# EAGLE design LilyPad-Simblee (EAGLE 7.5.0)
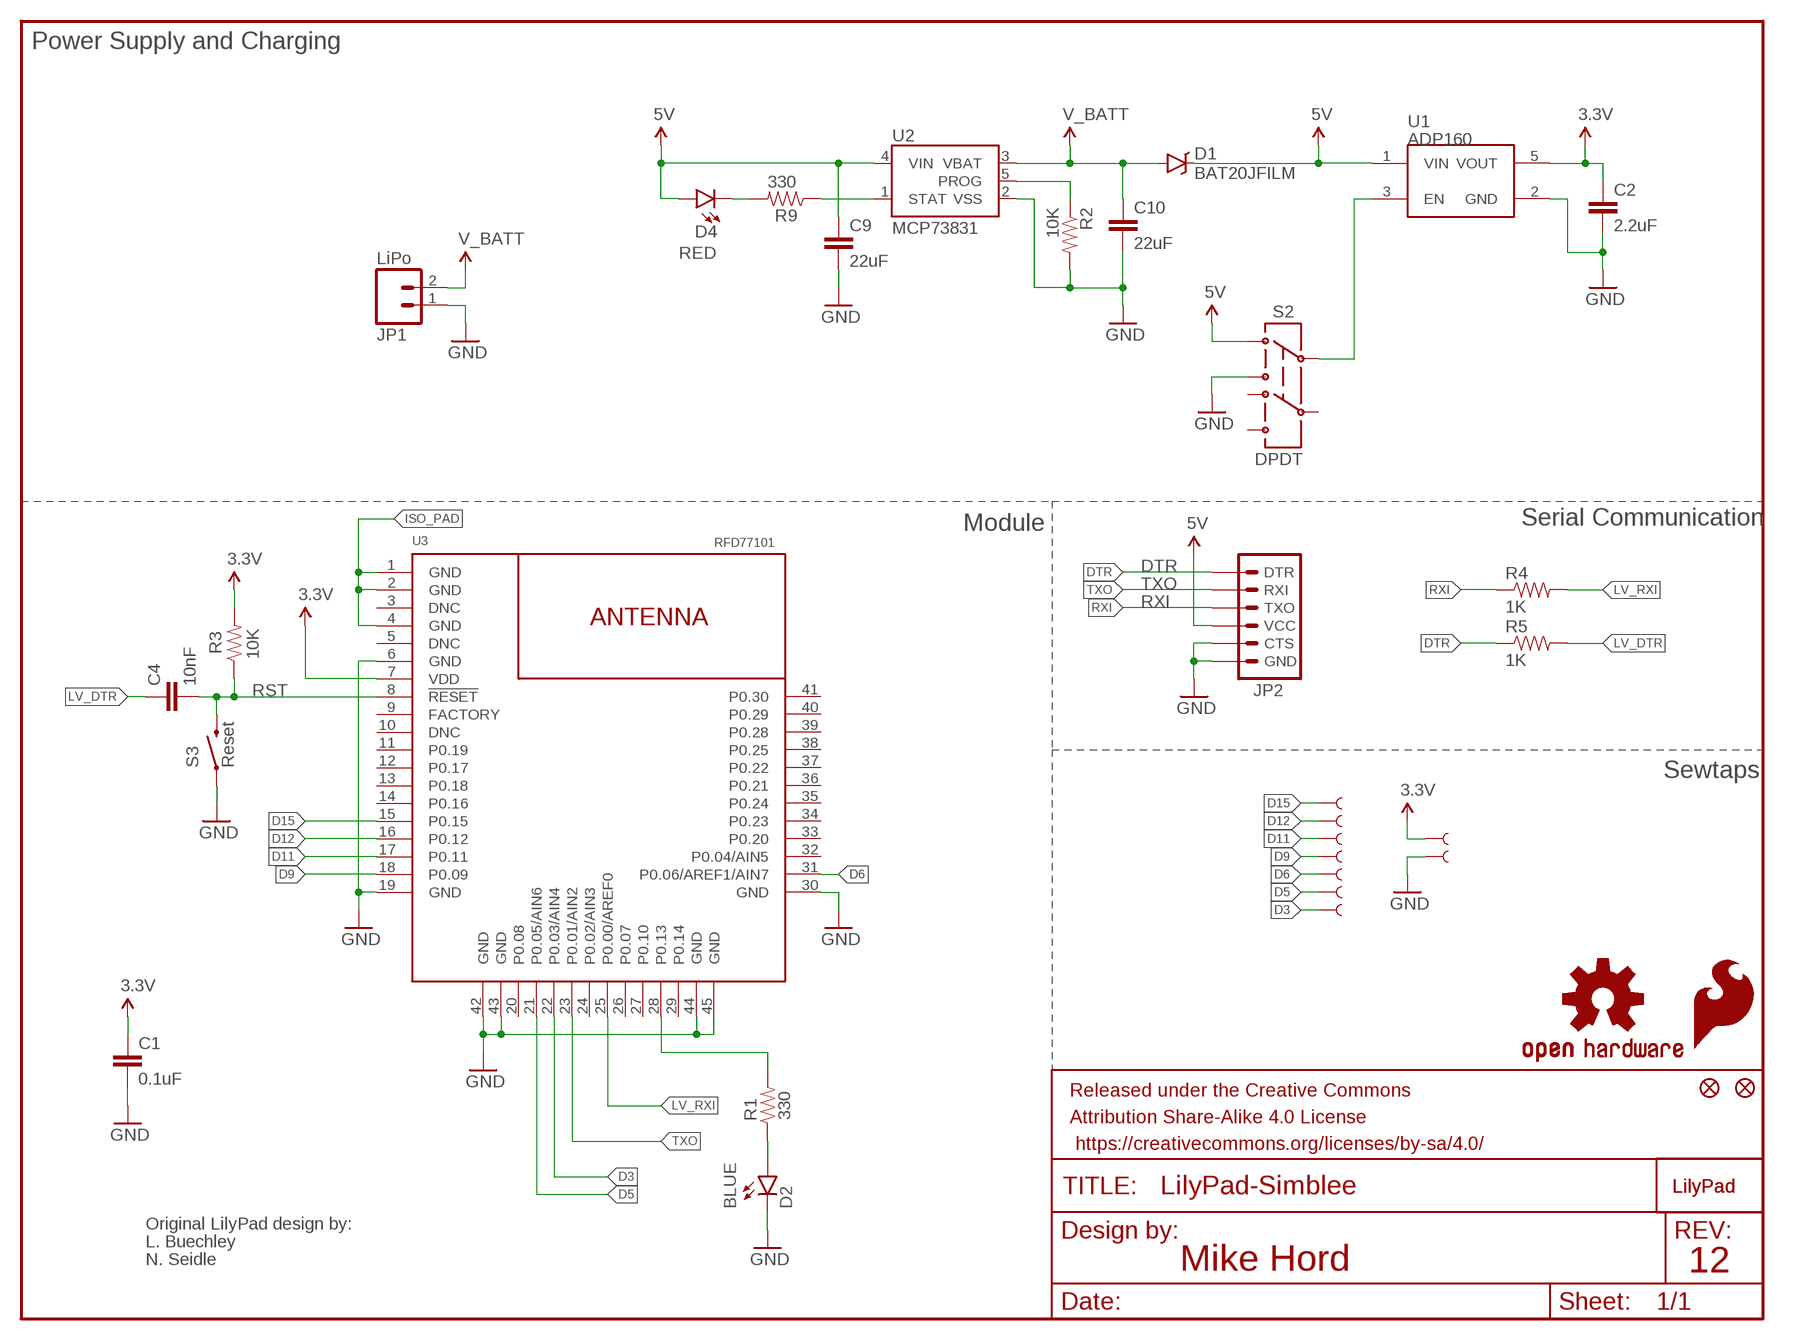
[diagram p0: schematic, sheet 1]

## Parts
A4/18  SEWTAP9  [PETAL-LONG-1-2SIDE]
A5/19  SEWTAP9  [PETAL-LONG-1-2SIDE]
C1  0.1uF  0.1UF-25V(+80/-20%)(0603)  [0603-CAP]
C2  2.2uF  2.2UF-10V-20%(0603)  [0603-CAP]
C4  10nF  10NF/10000PF-50V-10%(0603)  [0603-CAP]
C9  22uF  22UF-6.3V-20%(0805)  [0805]
C10  22uF  22UF-6.3V-20%(0805)  [0805]
D1  BAT20JFILM  [SOD-323]
D2  BLUE  LED-BLUE0603  [LED-0603]
D4  RED  LED-RED0603  [LED-0603]
FID1  FIDUCIALUFIDUCIAL  [MICRO-FIDUCIAL]
FID2  FIDUCIALUFIDUCIAL  [MICRO-FIDUCIAL]
FRAME1  FRAME-LETTER  [CREATIVE_COMMONS]
JP1  LiPo  M02-JST-2MM-SMT  [JST-2-SMD]
JP2  ARDUINO_SERIAL_PROGRAMSMD  [1X06-SMD]
LOGO1  SFE_LOGO_FLAME.1COP  [SFE_LOGO_FLAME_COPPER_.1]
LOGO2  OSHW-LOGOS-COPPER  [OSHW-LOGO-S_COPPER]
R1  330  330OHM1/10W1%(0603)  [0603-RES]
R2  10K  10KOHM-1/10W-1%(0603)0603  [0603-RES]
R3  10K  10KOHM-1/10W-1%(0603)0603  [0603-RES]
R4  1K  1KOHM-1/10W-1%(0603)  [0603-RES]
R5  1K  1KOHM-1/10W-1%(0603)  [0603-RES]
R9  330  330OHM1/10W1%(0603)  [0603-RES]
S2  DPDT  SWITCH-DPDTAYZ0202  [AYZ0202]
S3  Reset  SWITCH-MOMENTARY-2SMD  [TACTILE-SWITCH-SMD]
U1  ADP160  [SOT23-5]
U2  MCP73831  [SOT23-5]
U3  RFD77101  [RFD77101]
U$1  LOGO-LPL  [LOGO-L]
U$2  LOGO-LPLP  [LOGO-LILYPAD]
U$4  SEWTAP9  [PETAL-LONG-1-2SIDE]
U$35  SEWTAP9  [PETAL-LONG-1-2SIDE]
U$37  SEWTAP9  [PETAL-LONG-1-2SIDE]
U$39  SEWTAP9  [PETAL-LONG-1-2SIDE]
U$41  SEWTAP9  [PETAL-LONG-1-2SIDE]
U$43  SEWTAP9  [PETAL-LONG-1-2SIDE]
U$45  SEWTAP9  [PETAL-LONG-1-2SIDE]

## Nets
3.3V: C1.1 C2.1 R3.2 U1.5(VOUT) U3.7(VDD) U$43.1
5V: C9.1 D1.C D4.A JP2.4(VCC) S2.1 U1.1(VIN) U2.4(VIN)
D3: A5/19.1 U3.22(P0.03/AIN4)
D5: U3.21(P0.05/AIN6) U$39.1
D6: A4/18.1 U3.31(P0.06/AREF1/AIN7)
D9: U3.18(P0.09) U$4.1
D11: U3.17(P0.11) U$45.1
D12: U3.16(P0.12) U$37.1
D15: U3.15(P0.15) U$35.1
DTR: JP2.1(DTR) R5.1
GND: C1.2 C2.2 C9.2 C10.2 D2.C JP1.1 JP2.5(CTS) JP2.6(GND) R2.2 S2.3 S3.1 U1.2(GND) U2.2(VSS) U3.6(GND) U3.19(GND) U3.30(GND) U3.42(GND) U3.43(GND) U3.44(GND) U3.45(GND) U$41.1
ISO_PAD: U3.1(GND) U3.2(GND) U3.4(GND)
LV_DTR: C4.1 R5.2
LV_RXI: R4.2 U3.25(P0.00/AREF0)
N$1: R1.2 U3.28(P0.13)
N$2: D2.A R1.1
N$3: S2.2 U1.3(EN)
N$8: D4.C R9.2
PROG: R2.1 U2.5(PROG)
RST: C4.2 R3.1 S3.3 U3.8(!RESET!)
RXI: JP2.3(TXO) R4.1
STAT: R9.1 U2.1(STAT)
TXO: JP2.2(RXI) U3.23(P0.01/AIN2)
V_BATT: C10.1 D1.A JP1.2 U2.3(VBAT)
Unconnected: S2.4 S2.5 S2.6 U3.3(DNC) U3.5(DNC) U3.9(FACTORY) U3.10(DNC) U3.11(P0.19) U3.12(P0.17) U3.13(P0.18) U3.14(P0.16) U3.20(P0.08) U3.24(P0.02/AIN3) U3.26(P0.07) U3.27(P0.10) U3.29(P0.14) U3.32(P0.04/AIN5) U3.33(P0.20) U3.34(P0.23) U3.35(P0.24) U3.36(P0.21) U3.37(P0.22) U3.38(P0.25) U3.39(P0.28) U3.40(P0.29) U3.41(P0.30)

## Notes on the sheet
- Power Supply and Charging
- Module | Serial Communication
- Sewtaps
- Original LilyPad design by:
- L. Buechley
- N. Seidle
- Mike Hord | 12

## Library data of the parts
A4/18 A5/19 U$4 U$35 U$37 U$39 U$41 U$43 U$45 = LilyPad-Wearables:SEWTAP: Sew Taps for LilyPad Boards.
C1 = SparkFun-Capacitors:0.1UF-25V(+80/-20%)(0603): CAP-00810 Ceramic Standard decoupling cap; PROD_ID: CAP-00810
C2 = SparkFun-Capacitors:2.2UF-10V-20%(0603): CAP-07888; PROD_ID: CAP-07888
C4 = SparkFun-Capacitors:10NF/10000PF-50V-10%(0603): CAP-00867; PROD_ID: CAP-00867
C9 C10 = SparkFun-Capacitors:22UF-6.3V-20%(0805): CAP-08402 Ceramic; PROD_ID: CAP-08402
D1 = SparkFun-DiscreteSemi:BAT20JFILM: 23V, 1A Schottky diode, SOD-323 package; PROD_ID: DIO-11623
D2 = SparkFun-LED:LED-BLUE: Blue LEDs for production use Various blue LEDs stocked by SparkFun production 0603 - DIO-08575 Rebel - DIO-09553 1206 - DIO-09911; PROD_ID: DIO-08575
D4 = SparkFun-LED:LED-RED: Assorted Red LEDs LilyPad 1206- DIO-09912 1206- DIO-00809 0603- DIO-00819 "SMART" means more efficient and expensive; PROD_ID: DIO-00819
FID1 FID2 = SparkFun-Aesthetics:FIDUCIAL: Fiducial Alignment Points Various fiducial points for machine vision alignment.
FRAME1 = SparkFun-Aesthetics:FRAME-LETTER: Schematic Frame Standard 8.5x11 US Letter frame
JP1 = SparkFun-Connectors:M02: Standard 2-pin 0.1" header. Use with - straight break away headers ( PRT-00116) - right angle break away headers (PRT-00553) - swiss pins (PRT-00743) - machine pins (PRT-00117) - female headers (PRT-00115) Molex polarized connector foot print use with: PRT-08233 with associated crimp pins and housings. 2.54_SCREWTERM for use with PRT-10571. 3.5mm Screw Terminal footprints for PRT-08084 5mm Screw Terminal footprints for use with PRT-08432; PROD_ID: CONN-11443
JP2 = SparkFun-Connectors:ARDUINO_SERIAL_PROGRAM: FTDI connector footprints; PROD_ID: CONN-08971
LOGO1 = SparkFun-Aesthetics:SFE_LOGO_FLAME: SFE Logo, flame only This is the SparkFun flame logo. The logo on the schematic will always be the same size; the package variant is the height of the flame. Default layer for the logo on the board is tSilk.
LOGO2 = SparkFun-Aesthetics:OSHW-LOGO: Open Source Hardware Logo This logo indicates the piece of hardware it is found on incorporates a OSHW license and/or adheres to the definition of open source hardware found here: http://freedomdefined.org/OSHW
R1 R9 = SparkFun-Resistors:330OHM1/10W1%(0603): RES-00818; PROD_ID: RES-00818
R2 R3 = SparkFun-Resistors:10KOHM-1/10W-1%(0603): RES-00824; PROD_ID: RES-00824
R4 R5 = SparkFun-Resistors:1KOHM-1/10W-1%(0603): RES-07856; PROD_ID: RES-07856
S2 = SparkFun-Electromechanical:SWITCH-DPDT: DPDT Version of the COM-00597; PROD_ID: SWCH-08179
S3 = SparkFun-Electromechanical:SWITCH-MOMENTARY-2: Various NO switches- pushbuttons, reed, etc; PROD_ID: SWCH-08247
U1 = SparkFun-PowerIC:ADP160: Nanopower LDO Iq less than 1uA for low Iload; PROD_ID: VREG-11306
U2 = SparkFun-PowerIC:MCP73831: Miniature single cell, fully integrated Li-Ion, Li-polymer charge management controller http://ww1.microchip.com/downloads/en/DeviceDoc/20001984g.pdf IC-09995; PROD_ID: IC-09995
U3 = RFDigital:RFD77101: Simblee ™ BLE Module RFD77101 © 2015 RF Digital Corporation www.RFDigital.com www.Simblee.com PATENTS PENDING 04.01.2015; PROD_ID: COMP-13017
U$1 U$2 = LilyPad-Wearables:LOGO-LP

## Net classes
0 Default: width 0.203 mm
1 VCC: width 0.254 mm

## Board
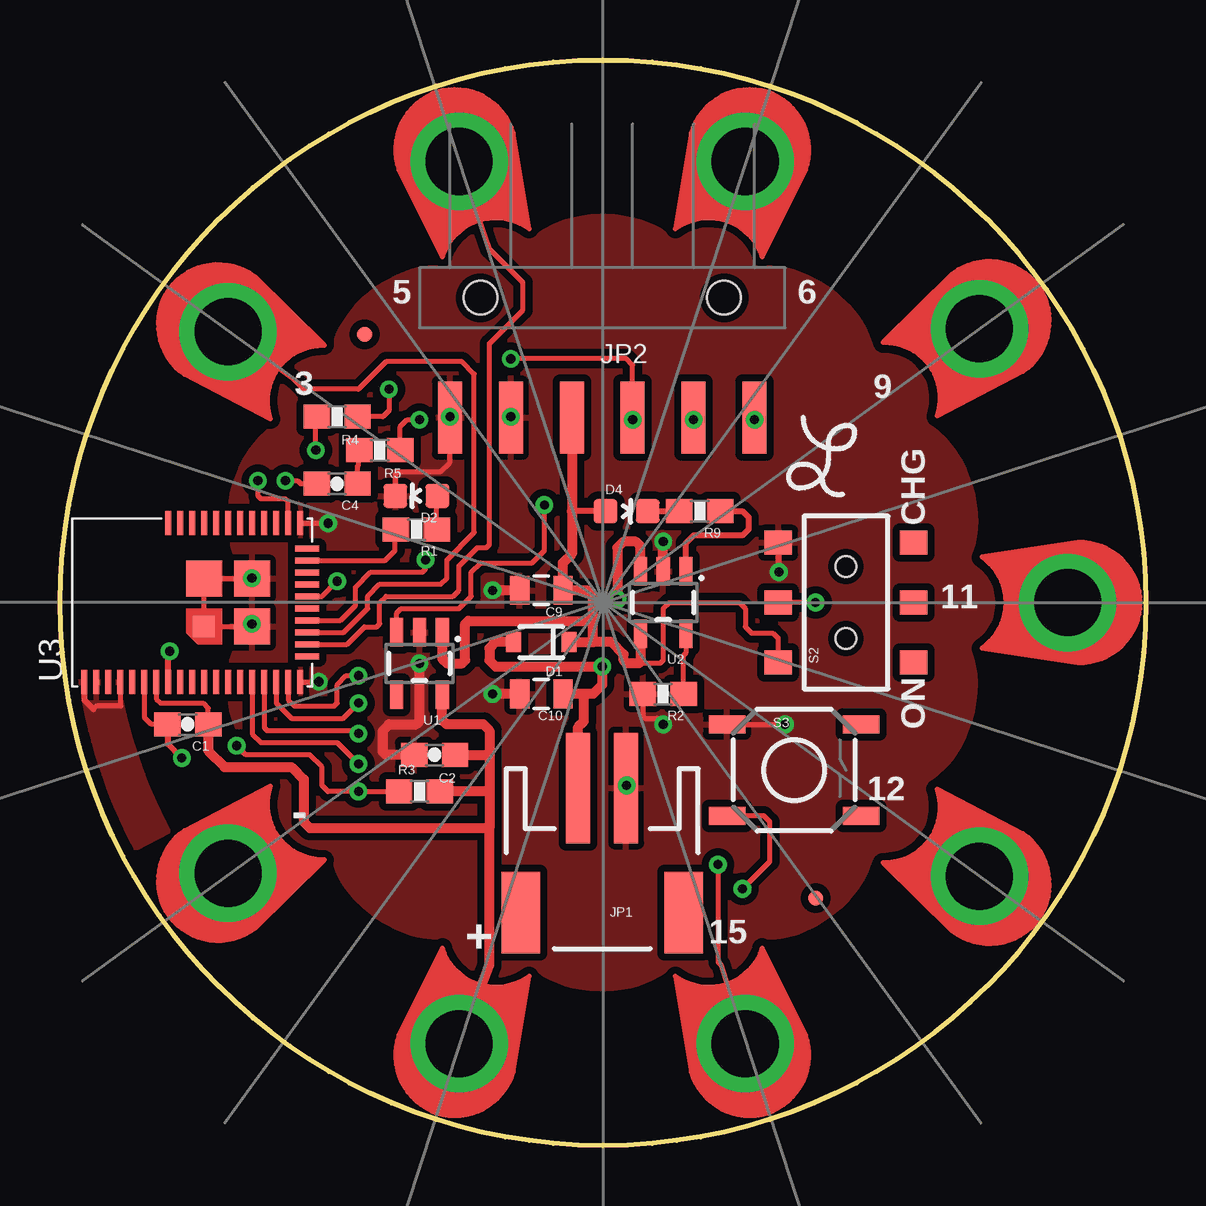
[diagram p1: board, top side]
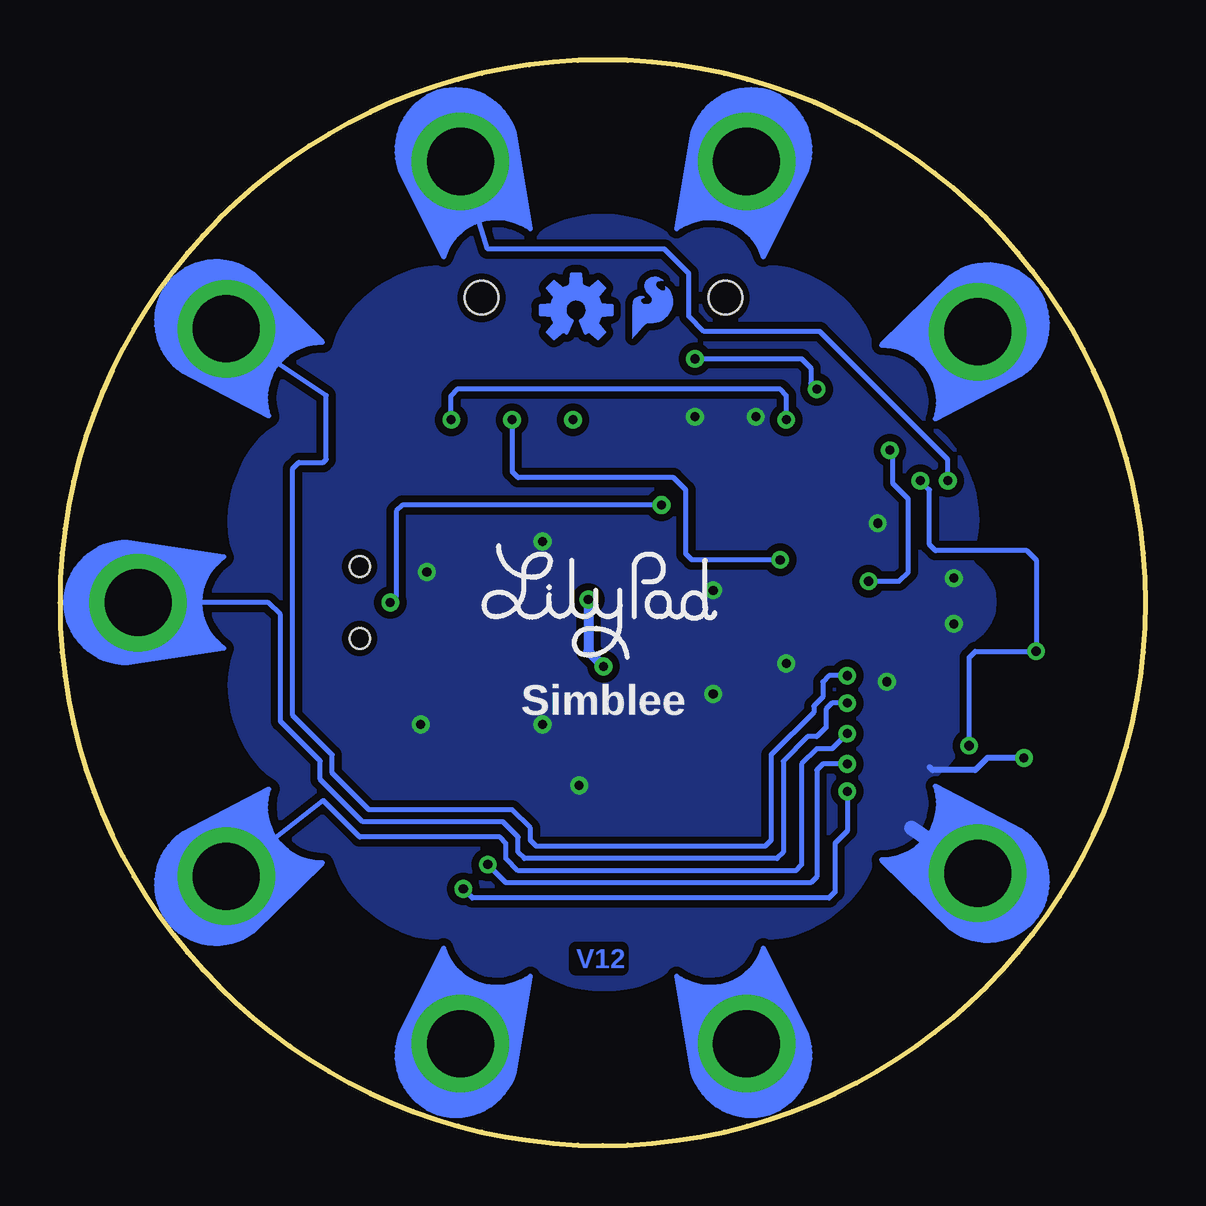
[diagram p2: board, bottom side, seen from below]

Size 45.26 x 45.25 mm. Coordinates in mm from the lower left corner, seen from the top.
Outline: 45.26,22.63 45.24,21.59 45.17,20.57 45.05,19.56 44.89,18.56 44.69,17.58 44.45,16.61 44.17,15.66 43.84,14.73 43.48,13.82 43.08,12.93 42.64,12.06 42.17,11.21 41.66,10.38 41.12,9.58 40.54,8.8 39.94,8.05 39.3,7.32 38.63,6.63 37.93,5.96 37.21,5.32 36.46,4.71 35.68,4.14 34.88,3.6 34.05,3.09 33.2,2.61 32.33,2.18 31.44,1.78 30.53,1.41 29.6,1.09 28.65,0.81 27.68,0.56 26.7,0.36 25.7,0.21 24.69,0.09 23.67,0.02 22.63,0 21.6,0.02 20.57,0.09 19.56,0.21 18.56,0.36 17.58,0.56 16.62,0.81 15.67,1.09 14.74,1.41 13.82,1.78 12.93,2.18 12.06,2.61 11.21,3.09 10.39,3.6 9.58,4.14 8.81,4.71 8.05,5.32 7.33,5.96 6.63,6.63 5.96,7.32 5.33,8.05 4.72,8.8 4.14,9.58 3.6,10.38 3.09,11.21 2.62,12.06 2.18,12.93 1.78,13.82 1.42,14.73 1.1,15.66 0.81,16.61 0.57,17.58 0.37,18.56 0.21,19.56 0.1,20.57 0.03,21.59 0,22.63 0.03,23.66 0.1,24.69 0.21,25.7 0.37,26.69 0.57,27.68 0.81,28.64 1.1,29.59 1.42,30.52 1.78,31.43 2.18,32.33 2.62,33.2 3.09,34.05 3.6,34.87 4.14,35.68 4.72,36.45 5.33,37.2 5.96,37.93 6.63,38.63 7.33,39.29 8.05,39.93 8.81,40.54 9.58,41.11 10.39,41.66 11.21,42.16 12.06,42.64 12.93,43.07 13.82,43.48 14.74,43.84 15.67,44.16 16.62,44.44 17.58,44.69 18.56,44.89 19.56,45.05 20.57,45.16 21.6,45.23 22.63,45.25 23.67,45.23 24.69,45.16 25.7,45.05 26.7,44.89 27.68,44.69 28.65,44.44 29.6,44.16 30.53,43.84 31.44,43.48 32.33,43.07 33.2,42.64 34.05,42.16 34.88,41.66 35.68,41.11 36.46,40.54 37.21,39.93 37.93,39.29 38.63,38.63 39.3,37.93 39.94,37.2 40.54,36.45 41.12,35.68 41.66,34.87 42.17,34.05 42.64,33.2 43.08,32.33 43.48,31.43 43.84,30.52 44.17,29.59 44.45,28.64 44.69,27.68 44.89,26.69 45.05,25.7 45.17,24.69 45.24,23.66 45.26,22.63
Copper layers (1*16): Top 0.035mm / dielectric 1.5mm / Bottom 0.035mm
Design rules "SparkFun-2-layer-TIGHT": minimum track width 7mil, minimum drill 15mil, track to track 7mil, track to pad 7mil, pad to pad 7mil, via to via 7mil, smd to smd 7mil, copper to edge 7mil, drill to drill 7mil, minimum pad ring 7mil, minimum via ring 7mil, stop-mask expansion 4mil, vias tented up to drill 20mil, thermal gap 10mil
tRestrict: area 1.1,19.1 to 1.4,19.6; area 1.1,18.6 to 1.4,18.8; area 1.6,18.6 to 2.4,18.8; area -0.2,-0.1 to 45.4,22.7; area -0.2,22.6 to 45.4,45.4
bRestrict: area -0.2,22.6 to 45.4,45.4; area -0.2,-0.1 to 45.4,22.7

### Footprints (pad centres in the part's own frame; a part is rotated, then mirrored left to right if it is on the bottom)
PETAL-LONG-1-2SIDE = drill 2.794 pad 4.064: 1 0.03,0
0603-CAP = smd 1.1 x 1: 1 -0.85,0; 2 0.85,0
0805 = smd 0.8 x 1.2: 1 -0.9,0; 2 0.9,0
SOD-323 = smd 0.63 x 0.83: A 1.15,0; C -1.15,0
LED-0603 = smd 1 x 1: A 0,-0.877; C 0,0.877
MICRO-FIDUCIAL = smd 0.635 x 0.635: 1 0,0
JST-2-SMD = smd 1 x 4.6: 1 -1,-3.7; 2 1,-3.7 | smd 1.6 x 3.4: NC1 -3.4,1.5; NC2 3.4,1.5
1X06-SMD = smd 1 x 3: 1 -6.35,5; 2 -3.81,5; 3 -1.27,5; 4 1.27,5; 5 3.81,5; 6 6.35,5 | hole 1.4: -5.08,0; 5.08,0
0603-RES = smd 1.1 x 1: 1 -0.85,0; 2 0.85,0
AYZ0202 = smd 1 x 1.15: 1 -2.5,2.825; 2 0,2.825; 3 2.5,2.825; 4 -2.5,-2.825; 5 0,-2.825; 6 2.5,-2.825 | hole 0.85: 1.5,0; -1.5,0
TACTILE-SWITCH-SMD = smd 1.524 x 0.762: 1 -2.794,1.905; 2 2.794,1.905; 3 -2.794,-1.905; 4 2.794,-1.905
SOT23-5 = smd 0.55 x 1.2: 1 -0.95,-1.3; 2 0,-1.3; 3 0.95,-1.3; 4 0.95,1.3; 5 -0.95,1.3
RFD77101 = smd 1 x 0.254: 1 0,0; 2 0,-0.5; 3 0,-1; 4 0,-1.5; 5 0,-2; 6 0,-2.5; 7 0,-3; 8 0,-3.5; 9 0,-4; 10 0,-4.5; 11 0,-5; 12 0,-5.5; 13 0,-6; 14 0,-6.5; 15 0,-7; 16 0,-7.5; 17 0,-8; 18 0,-8.5; 19 0,-9; 30 6.61,-9; 31 6.61,-8.5; 32 6.61,-8; 33 6.61,-7.5; 34 6.61,-7; 35 6.61,-6.5; 36 6.61,-6; 37 6.61,-5.5; 38 6.61,-5; 39 6.61,-4.5; 40 6.61,-4; 41 6.61,-3.5 | smd 0.254 x 1: 20 1.055,-9.29; 21 1.555,-9.29; 22 2.055,-9.29; 23 2.555,-9.29; 24 3.055,-9.29; 25 3.555,-9.29; 26 4.055,-9.29; 27 4.555,-9.29; 28 5.055,-9.29; 29 5.555,-9.29 | smd 0.9 x 0.9: 42 2.3,-4.99 | smd 1.5 x 1.5: 43 2.3,-6.99; 44 4.3,-6.99; 45 4.3,-4.99

### Placement (x,y rotation side)
A4/18  28.57,41.05 252 top
A5/19  6.98,33.94 324 top
C1  5.33,17.55 180 top
C2  15.62,16.28 180 top
C4  11.55,27.59 180 top
C9  20.06,23.14 180 top
C10  20.06,18.82 180 top
D1  20.06,20.98 180 top
D2  14.86,27.08 90 top
D4  23.62,26.44 270 top
FID1  12.7,33.81 0 top
FID2  31.49,10.31 0 top
FRAME1  65.78,-9.12 0 top  (outside the outline)
JP1  22.6,11.2 180 top
JP2  22.6,35.33 180 top
LOGO1  21.71,33.3 0 bottom
LOGO2  23.75,34.83 0 bottom
R1  14.86,25.68 180 top
R2  25.14,18.82 180 top
R3  14.98,14.76 0 top
R4  11.55,30.38 180 top
R5  13.33,28.98 180 top
R9  26.67,26.44 180 top
S2  32.76,22.63 90 top
S3  30.6,15.65 0 top
U1  14.98,20.09 180 top
U2  25.14,22.63 180 top
U3  1.01,19.33 90 top
U$1  31.75,28.73 0 top
U$2  22.73,23.01 0 bottom
U$4  38.35,34.06 216 top
U$35  28.57,4.22 108 top
U$37  38.35,11.2 144 top
U$39  16.63,41.05 288 top
U$41  6.98,11.33 36 top
U$43  16.63,4.22 72 top
U$45  42.03,22.63 180 top

### Tracks (layer width: path | path; a pad name or v marks a point on that pad's centre or on a via)
3.3V
  Top 0.203: U3.7 4.01,18.62 4.19,18.44 5.97,18.44 6.18,18.23 C1.1
  Top 0.406: U$43.1 17.9,7.52 17.9,13.24 | R3.2 17.78,14.76 17.9,14.63 | 17.9,13.24 10.41,13.24 10.16,13.49 10.16,15.27 9.65,15.78 6.86,15.78 6.18,16.45 C1.1 | C2.1 17.9,16.28 | 17.9,16.28 17.9,17.3 17.65,17.55 16.13,17.55 15.93,17.75 U1.5 | 17.9,16.28 17.9,14.63 | 17.9,14.63 17.9,13.24
5V
  Top 0.203: 29.9,20.09 S2.1 29.94,21.14 29.72,21.36 28.83,21.36 28.57,21.62 28.57,22.38 28.32,22.63 25.4,22.63 25.14,22.38 25.14,20.22 25.02,20.09 24.26,20.09 24.19,20.16
  Top 0.254: D4.A 21.33,26.44
  Top 0.406: 22.22,21.87 17.02,21.87 16.89,21.74 16.89,20.22 16.76,20.09 16.13,20.09 15.93,20.29 U1.1 | JP2.4 21.33,26.44 21.33,24.67 20.95,24.28 20.95,23.15 C9.1 21.97,23.14 22.22,22.89 22.22,21.87 | D1.C 22.22,20.98 | 22.22,20.98 22.22,21.87 | U2.4 24.19,20.16 24.13,20.09 23.62,20.09 23.49,20.22 23.49,20.47 22.98,20.98 22.22,20.98
D3
  Top 0.203: U3.22 11.83,21.39 12.82,22.38 12.82,22.89 13.33,23.4 15.87,23.4 16.13,23.65 16.13,24.41 17.27,25.55 17.27,32.16 16.76,32.67 13.59,32.67 12.44,31.52 10.16,31.52 9.78,31.9 A5/19.1
D5
  Top 0.203: U3.21 11.97,20.89 12.7,21.62 13.21,21.62 13.33,21.74 13.33,22.63 13.59,22.89 16.38,22.89 16.63,23.14 16.63,24.16 17.4,24.92 17.78,24.92 17.9,25.05 17.9,33.43 19.3,34.83 19.3,35.97 17.9,37.37 U$39.1
D6  (via drill 0.38)
  Top 0.203: U3.31 9.51,26.83 9.4,26.95 8.38,26.95 8.25,27.08 v8.25,27.71
  Bottom 0.203: v8.25,27.71 8.25,28.6 13.59,33.94 18.41,33.94 19.05,34.57 19.05,36.35 20.06,37.37 27.43,37.37 A4/18.1
D9  (via drill 0.38)
  Top 0.203: U3.18 9.51,18.58 9.78,18.32 11.43,18.32 11.55,18.44 11.55,19.2 11.94,19.59 v12.44,19.59
  Bottom 0.203: v12.44,19.59 13.21,19.59 13.46,19.33 13.46,18.7 13.84,18.32 13.84,18.06 15.62,16.28 15.62,12.73 15.87,12.47 25.4,12.47 25.65,12.73 25.65,13.24 26.41,14 32.38,14 33.91,15.52 33.91,16.28 35.56,17.93 35.56,28.22 35.3,28.48 34.29,28.48 34.16,28.6 34.16,31.27 U$4.1
D11  (via drill 0.38)
  Top 0.203: U3.17 9.01,18.44 9.65,17.81 11.81,17.81 v12.44,18.44 12.19,18.19
  Bottom 0.203: v12.44,18.44 13.08,18.44 13.33,18.19 13.33,17.43 13.71,17.05 14.09,17.05 15.11,16.03 15.11,12.22 15.36,11.97 25.91,11.97 26.16,12.22 26.16,12.85 26.79,13.49 32.64,13.49 34.41,15.27 34.41,16.03 36.07,17.68 36.07,22.13 36.57,22.63 U$45.1
D12  (via drill 0.38)
  Top 0.203: U3.16 8.51,17.42 8.63,17.3 12.32,17.3 v12.44,17.17
  Bottom 0.203: v12.44,17.17 13.08,16.54 13.71,16.54 14.35,15.9 14.35,11.71 14.6,11.46 26.16,11.46 26.67,11.97 26.67,12.6 26.92,12.85 32.76,12.85 34.29,14.38 U$37.1
D15  (via drill 0.38)
  Top 0.203: U3.15 8.01,17.16 8.38,16.79 11.55,16.79 v12.44,15.9 | v27.43,11.71 27.43,7.65 27.56,7.52 U$35.1
  Bottom 0.203: v12.44,15.9 13.46,15.9 13.71,15.65 13.71,11.2 13.97,10.95 26.67,10.95 v27.43,11.71
DTR  (via drill 0.38)
  Top 0.203: R5.1 14.18,29.96 14.48,30.25 v14.98,30.25 | JP2.1 v28.95,30.25
  Bottom 0.203: v14.98,30.25 14.98,31.27 15.24,31.52 28.7,31.52 28.95,31.27 v28.95,30.25
GND  (via drill 0.38)
  Top 0.203: U3.19 v10.79,19.33 | 11.3,25.81 v11.17,25.94 U3.30 | v16.25,30.38 JP2.6 16.25,28.48 15.87,28.09 14.09,28.09 13.98,27.98 D2.C | JP2.5 v18.79,30.38 | v8,21.74 U3.43 U3.42 U3.45 U3.44 v8,23.65 | S3.1 v30.22,17.55 | R2.2 24.29,17.9 24.38,17.81 24.89,17.81 v25.14,17.55 | C1.2 3.81,17.55 3.51,17.85 U3.6
  Top 0.254: S2.3 29.94,23.93 v29.97,23.9 | C1.2 4.48,16.75 v5.08,16.16
  Top 0.406: C9.2 v18.03,23.14 | C10.2 v18.03,18.82 | U2.2 v25.14,25.17 | C2.2 13.59,16.28 13.46,16.41 13.46,17.3 13.71,17.55 14.86,17.55 14.98,17.68 v14.98,20.09 | 23.76,14.9 JP1.1 23.62,14.92 v23.62,15.01
  Bottom 0.254: v5.08,16.16 6.6,16.16 7.11,15.65 8.89,15.65 9.01,15.78
  Bottom 0.61: U$41.1 9.78,13.24
  pour Bottom (isolate 0.305): 8.29,15.18 7.92,15.53 7.58,15.95 7.27,16.43 7,16.96 6.79,17.52 6.64,18.1 6.54,18.68 6.51,19.25 6.54,19.79 6.63,20.29 6.79,20.75 6.5,20.98 6.25,21.26 6.06,21.57 5.91,21.92 5.82,22.28 5.79,22.65 5.82,23.02 5.91,23.38 6.06,23.72 6.25,24.03 6.5,24.31 6.79,24.55 6.65,25.01 6.55,25.52 6.52,26.06 6.55,26.63 6.65,27.21 6.81,27.79 7.02,28.35 7.28,28.87 7.59,29.35 7.94,29.77 8.31,30.13 8.7,30.4 8.61,30.76 8.57,31.13 8.6,31.5 8.68,31.86 8.82,32.2 9.01,32.52 9.26,32.8 9.54,33.04 9.86,33.23 10.2,33.37 10.56,33.45 10.93,33.48 11.09,33.93 11.31,34.4 11.61,34.85 11.97,35.3 12.39,35.71 12.85,36.08 13.35,36.41 13.88,36.68 14.41,36.89 14.94,37.03 15.44,37.09 15.92,37.09 16.06,37.43 16.25,37.75 16.48,38.04 16.76,38.28 17.08,38.47 17.42,38.62 17.78,38.7 18.15,38.73 18.52,38.7 18.88,38.61 19.22,38.46 19.54,38.26 19.94,38.54 20.39,38.78 20.89,38.98 21.44,39.12 22.03,39.21 22.62,39.24 23.22,39.21 23.8,39.12 24.35,38.98 24.86,38.78 25.31,38.54 25.69,38.25 26.01,38.45 26.35,38.6 26.71,38.69 27.08,38.72 27.45,38.69 27.81,38.61 28.15,38.46 28.47,38.27 28.75,38.03 28.98,37.74 29.17,37.42 29.31,37.08 29.79,37.07 30.3,37 30.83,36.86 31.36,36.65 31.88,36.38 32.38,36.06 32.85,35.68 33.27,35.27 33.63,34.83 33.92,34.37 34.14,33.91 34.28,33.45 34.65,33.43 35.02,33.35 35.36,33.21 35.68,33.02 35.96,32.78 36.2,32.49 36.4,32.18 36.54,31.83 36.62,31.47 36.65,31.1 36.61,30.73 36.52,30.37 36.91,30.08 37.28,29.73 37.62,29.31 37.93,28.83 38.19,28.3 38.41,27.74 38.56,27.16 38.66,26.58 38.69,26.01 38.66,25.47 38.57,24.97 38.41,24.51 38.7,24.28 38.94,24 39.14,23.69 39.29,23.34 39.37,22.98 39.4,22.61 39.37,22.24 39.29,21.88 39.14,21.54 38.94,21.23 38.7,20.95 38.41,20.71 38.55,20.25 38.65,19.74 38.68,19.2 38.64,18.63 38.55,18.05 38.39,17.47 38.18,16.91 37.91,16.39 37.61,15.91 37.26,15.49 36.89,15.13 36.5,14.86 36.59,14.5 36.63,14.13 36.6,13.76 36.52,13.4 36.38,13.06 36.18,12.74 35.94,12.46 35.66,12.22 35.34,12.03 35,11.89 34.64,11.81 34.26,11.78 34.1,11.33 33.88,10.86 33.59,10.41 33.23,9.96 32.81,9.55 32.34,9.18 31.84,8.85 31.32,8.58 30.79,8.37 30.26,8.23 29.76,8.17 29.28,8.17 29.14,7.83 28.95,7.51 28.71,7.22 28.43,6.98 28.12,6.79 27.78,6.64 27.41,6.56 27.04,6.53 26.67,6.56 26.32,6.65 25.97,6.8 25.66,7 25.26,6.72 24.81,6.48 24.31,6.28 23.75,6.14 23.17,6.05 22.57,6.02 21.98,6.05 21.4,6.14 20.84,6.28 20.34,6.48 19.89,6.72 19.51,7.01 19.19,6.81 18.85,6.66 18.49,6.57 18.12,6.54 17.75,6.57 17.39,6.65 17.05,6.8 16.73,6.99 16.45,7.23 16.21,7.52 16.02,7.84 15.89,8.18 15.4,8.19 14.9,8.26 14.37,8.4 13.84,8.61 13.32,8.88 12.81,9.2 12.35,9.58 11.93,9.99 11.57,10.43 11.27,10.89 11.05,11.35 10.91,11.81 10.54,11.83 10.18,11.91 9.84,12.05 9.52,12.24 9.24,12.48 8.99,12.77 8.8,13.08 8.66,13.43 8.58,13.79 8.55,14.16 8.59,14.53 8.68,14.89
  pour Top (isolate 0.305): 8.29,15.18 7.92,15.53 7.58,15.95 7.27,16.43 7,16.96 6.79,17.52 6.64,18.1 6.54,18.68 6.51,19.25 6.54,19.79 6.63,20.29 6.79,20.75 6.5,20.98 6.25,21.26 6.06,21.57 5.91,21.92 5.82,22.28 5.79,22.65 5.82,23.02 5.91,23.38 6.06,23.72 6.25,24.03 6.5,24.31 6.79,24.55 6.65,25.01 6.55,25.52 6.52,26.06 6.55,26.63 6.65,27.21 6.81,27.79 7.02,28.35 7.28,28.87 7.59,29.35 7.94,29.77 8.31,30.13 8.7,30.4 8.61,30.76 8.57,31.13 8.6,31.5 8.68,31.86 8.82,32.2 9.01,32.52 9.26,32.8 9.54,33.04 9.86,33.23 10.2,33.37 10.56,33.45 10.93,33.48 11.09,33.93 11.31,34.4 11.61,34.85 11.97,35.3 12.39,35.71 12.85,36.08 13.35,36.41 13.88,36.68 14.41,36.89 14.94,37.03 15.44,37.09 15.92,37.09 16.06,37.43 16.25,37.75 16.48,38.04 16.76,38.28 17.08,38.47 17.42,38.62 17.78,38.7 18.15,38.73 18.52,38.7 18.88,38.61 19.22,38.46 19.54,38.26 19.94,38.54 20.39,38.78 20.89,38.98 21.44,39.12 22.03,39.21 22.62,39.24 23.22,39.21 23.8,39.12 24.35,38.98 24.86,38.78 25.31,38.54 25.69,38.25 26.01,38.45 26.35,38.6 26.71,38.69 27.08,38.72 27.45,38.69 27.81,38.61 28.15,38.46 28.47,38.27 28.75,38.03 28.98,37.74 29.17,37.42 29.31,37.08 29.79,37.07 30.3,37 30.83,36.86 31.36,36.65 31.88,36.38 32.38,36.06 32.85,35.68 33.27,35.27 33.63,34.83 33.92,34.37 34.14,33.91 34.28,33.45 34.65,33.43 35.02,33.35 35.36,33.21 35.68,33.02 35.96,32.78 36.2,32.49 36.4,32.18 36.54,31.83 36.62,31.47 36.65,31.1 36.61,30.73 36.52,30.37 36.91,30.08 37.28,29.73 37.62,29.31 37.93,28.83 38.19,28.3 38.41,27.74 38.56,27.16 38.66,26.58 38.69,26.01 38.66,25.47 38.57,24.97 38.41,24.51 38.7,24.28 38.94,24 39.14,23.69 39.29,23.34 39.37,22.98 39.4,22.61 39.37,22.24 39.29,21.88 39.14,21.54 38.94,21.23 38.7,20.95 38.41,20.71 38.55,20.25 38.65,19.74 38.68,19.2 38.64,18.63 38.55,18.05 38.39,17.47 38.18,16.91 37.91,16.39 37.61,15.91 37.26,15.49 36.89,15.13 36.5,14.86 36.59,14.5 36.63,14.13 36.6,13.76 36.52,13.4 36.38,13.06 36.18,12.74 35.94,12.46 35.66,12.22 35.34,12.03 35,11.89 34.64,11.81 34.26,11.78 34.1,11.33 33.88,10.86 33.59,10.41 33.23,9.96 32.81,9.55 32.34,9.18 31.84,8.85 31.32,8.58 30.79,8.37 30.26,8.23 29.76,8.17 29.28,8.17 29.14,7.83 28.95,7.51 28.71,7.22 28.43,6.98 28.12,6.79 27.78,6.64 27.41,6.56 27.04,6.53 26.67,6.56 26.32,6.65 25.97,6.8 25.66,7 25.26,6.72 24.81,6.48 24.31,6.28 23.75,6.14 23.17,6.05 22.57,6.02 21.98,6.05 21.4,6.14 20.84,6.28 20.34,6.48 19.89,6.72 19.51,7.01 19.19,6.81 18.85,6.66 18.49,6.57 18.12,6.54 17.75,6.57 17.39,6.65 17.05,6.8 16.73,6.99 16.45,7.23 16.21,7.52 16.02,7.84 15.89,8.18 15.4,8.19 14.9,8.26 14.37,8.4 13.84,8.61 13.32,8.88 12.81,9.2 12.35,9.58 11.93,9.99 11.57,10.43 11.27,10.89 11.05,11.35 10.91,11.81 10.54,11.83 10.18,11.91 9.84,12.05 9.52,12.24 9.24,12.48 8.99,12.77 8.8,13.08 8.66,13.43 8.58,13.79 8.55,14.16 8.59,14.53 8.68,14.89
ISO_PAD
  Top 0.203: U3.4 2.51,18.34 2.54,18.32 1.52,18.32 1.39,18.19
  Top 0.254: U3.1 1.01,18.57 1.39,18.19
  pour Top: 4.52,13.1 4.32,13.49 3.94,14.27 3.6,15.07 3.45,15.47 3.3,15.88 3.02,16.7 2.9,17.12 2.68,17.96 2.5,18.8 2.42,19.23 2.35,19.66 0.81,19.66 0.88,19.18 0.96,18.71 1.16,17.77 1.27,17.3 1.4,16.84 1.53,16.37 1.67,15.92 1.83,15.46 1.99,15.01 2.16,14.56 2.34,14.12 2.74,13.24 2.95,12.81 3.17,12.38
LV_DTR
  Top 0.203: C4.1 12.4,28.31 12.44,28.35 12.44,28.94 R5.2
LV_RXI  (via drill 0.38)
  Top 0.203: U3.25 10.92,22.89 v11.55,23.52 | v10.67,28.98 10.67,30.34 R4.2
  Bottom 0.203: v11.55,23.52 10.28,23.52 9.9,23.9 9.9,26.95 10.54,27.59 10.54,28.86 v10.67,28.98
N$1
  Top 0.203: U3.28 13.56,24.39 13.97,24.79 13.97,25.64 R1.2
N$2
  Top 0.203: R1.1 15.71,27.05 D2.A
N$3  (via drill 0.38)
  Top 0.203: v20.19,26.7 20.19,24.79 19.68,24.28 17.52,24.28 17.14,23.9 17.14,22.89 16.63,22.38 14.22,22.38 14.03,22.19 U1.3 | v31.49,22.63 S2.2
  Bottom 0.203: v20.19,26.7 30.99,26.7 31.24,26.44 31.24,22.89 v31.49,22.63
N$8
  Top 0.254: D4.C R9.2
PROG
  Top 0.203: R2.1 25.99,20.44 26.09,20.54 U2.5
RST  (via drill 0.38)
  Top 0.203: R3.1 v12.44,14.76 11.17,14.76 10.92,15.01 10.92,15.78 10.41,16.28 7.74,16.28 v7.36,16.66 | v28.45,10.7 29.59,11.84 29.59,13.49 29.33,13.74 S3.3 | v9.4,27.71 9.9,27.71 10.03,27.59 C4.2
  Top 0.254: U3.8 4.51,20.55 v4.57,20.6
  Bottom 0.203: v12.44,14.76 12.44,13.11 12.95,12.6 12.95,10.57 13.21,10.31 28.06,10.31 v28.45,10.7 | v9.4,27.71 9.01,27.33 9.01,25.05 8.76,24.79 4.95,24.79 4.57,24.41 v4.57,20.6 7.11,20.6 7.36,20.35 v7.36,16.66
RXI  (via drill 0.38)
  Top 0.203: JP2.3 v23.87,30.25 23.87,32.54 23.62,32.79 v18.79,32.79 | v13.71,31.52 13.71,30.63 13.46,30.38 R4.1
  Bottom 0.203: v18.79,32.79 14.35,32.79 13.97,32.41 13.97,31.78 v13.71,31.52
STAT
  Top 0.254: U2.1 26.09,25.11 26.41,25.43 28.45,25.43 28.7,25.68 28.7,26.19 28.45,26.44 R9.1
TXO  (via drill 0.38)
  Top 0.203: U3.23 11.7,21.89 12.32,22.51 12.32,23.27 12.95,23.9 15.11,23.9 15.24,24.03 v15.24,24.41 | JP2.2 v26.41,30.25
  Bottom 0.203: v15.24,24.41 18.92,24.41 19.17,24.67 19.17,27.33 19.68,27.84 26.16,27.84 26.41,28.09 v26.41,30.25
V_BATT  (via drill 0.38)
  Top 0.406: 21.84,18.82 22.22,18.82 22.6,19.2 v22.6,19.97 18.16,19.97 17.9,20.22 17.9,20.73 18.16,20.98 D1.A | 21.84,18.82 C10.1 20.95,18.83 | JP1.2 21.6,17.44 21.84,17.68 21.84,18.82 | U2.3 24.19,24.98 24,25.17 23.49,25.17 23.24,24.92 v23.24,22.76
  Bottom 0.406: v23.24,22.76 23.24,20.6 v22.6,19.97

### Text on the board
Bottom: V12
tPlace: 5 | 6 | 3 | 9 | CHG | 11 | ON | 12 | - | 15 | +
bPlace: Simblee
tDocu: NOTE: Use 0.032" board thickness! | Mike Hord